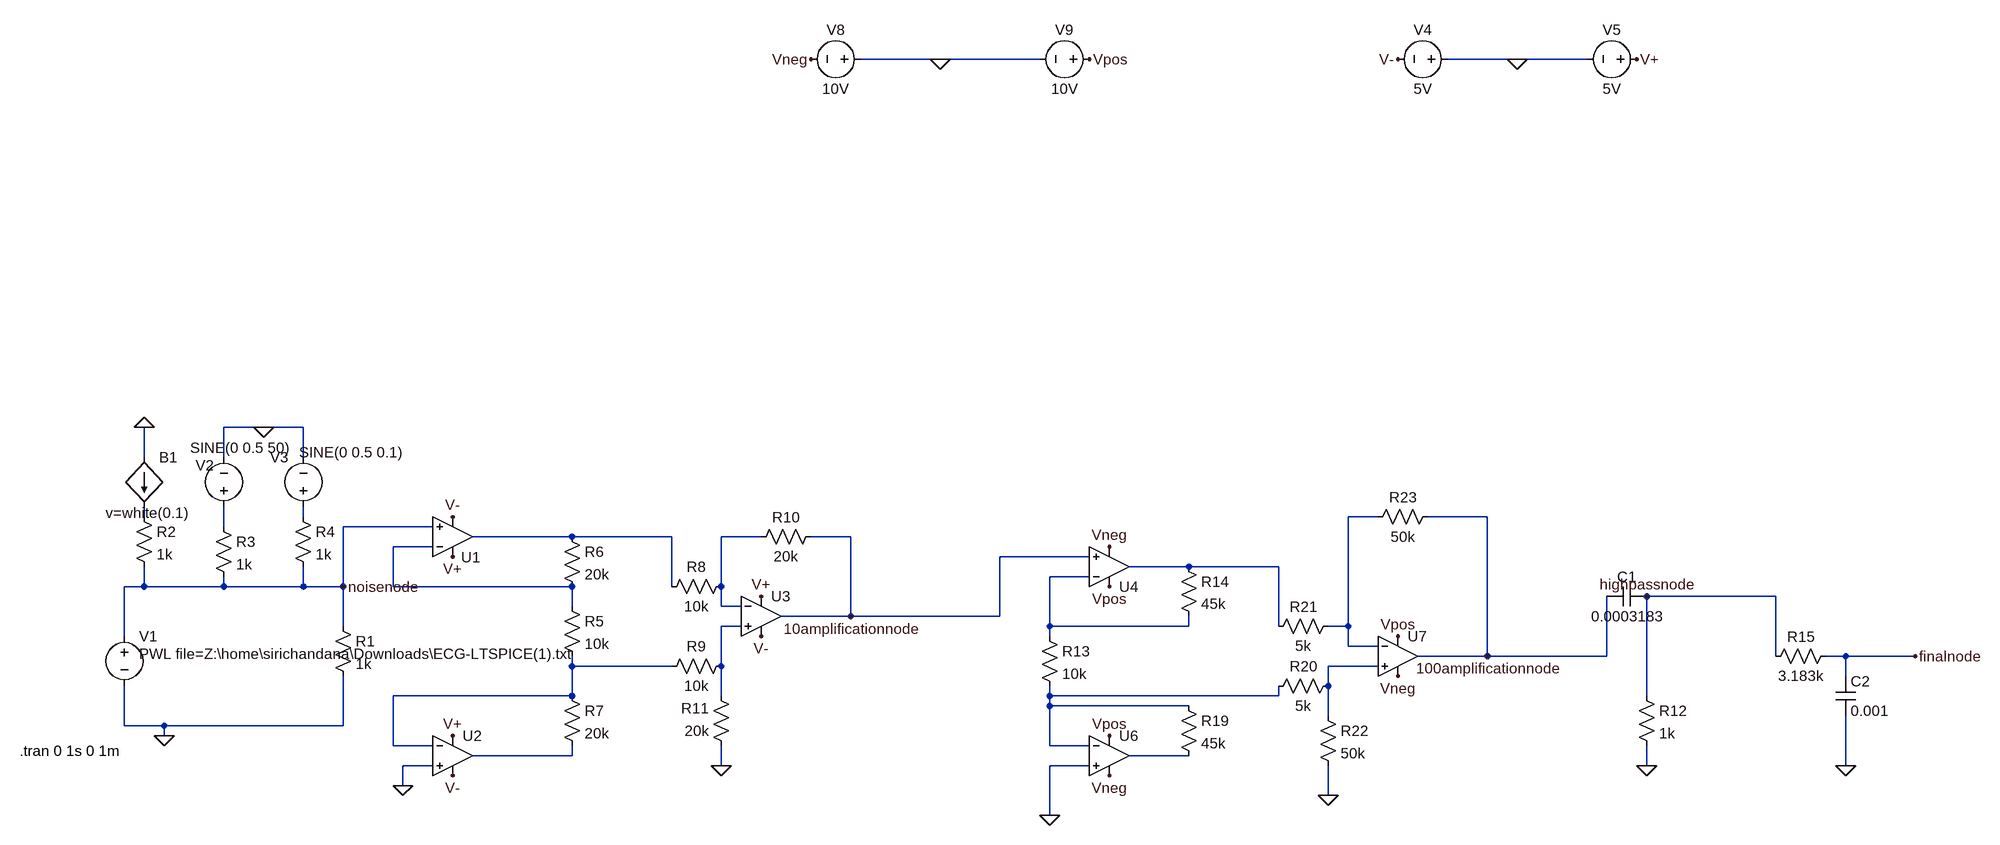
[diagram p0: schematic NEWsirichandanawinterprojectps1.asc]
NEWsirichandanawinterprojectps1.asc, the LTspice schematic file:
Version 4
SHEET 1 16100 740
WIRE -1392 -560 -1520 -560
WIRE -1232 -560 -1392 -560
WIRE -464 -560 -576 -560
WIRE -352 -560 -464 -560
WIRE -2480 32 -2544 32
WIRE -2416 32 -2480 32
WIRE -2672 80 -2672 32
WIRE -2544 80 -2544 32
WIRE -2416 80 -2416 32
WIRE -2672 176 -2672 160
WIRE -2416 176 -2416 160
WIRE -688 176 -736 176
WIRE -512 176 -608 176
WIRE -2544 192 -2544 160
WIRE -2208 192 -2352 192
WIRE -1984 208 -2144 208
WIRE -1824 208 -1984 208
WIRE -1680 208 -1744 208
WIRE -1536 208 -1600 208
WIRE -2208 224 -2272 224
WIRE -1152 240 -1296 240
WIRE -992 256 -1088 256
WIRE -848 256 -992 256
WIRE -1152 272 -1216 272
WIRE -2672 288 -2672 256
WIRE -2672 288 -2704 288
WIRE -2544 288 -2544 272
WIRE -2544 288 -2672 288
WIRE -2416 288 -2416 256
WIRE -2416 288 -2544 288
WIRE -2352 288 -2352 192
WIRE -2352 288 -2416 288
WIRE -2272 288 -2272 224
WIRE -1984 288 -2272 288
WIRE -1824 288 -1824 208
WIRE -1744 288 -1744 208
WIRE -48 304 -256 304
WIRE -1984 320 -1984 288
WIRE -1744 320 -1744 288
WIRE -1712 320 -1744 320
WIRE -1536 336 -1536 208
WIRE -1536 336 -1648 336
WIRE -1296 336 -1296 240
WIRE -1296 336 -1536 336
WIRE -2352 352 -2352 288
WIRE -1712 352 -1744 352
WIRE -1216 352 -1216 272
WIRE -992 352 -992 336
WIRE -992 352 -1216 352
WIRE -848 352 -848 256
WIRE -736 352 -736 176
WIRE -736 352 -768 352
WIRE -2704 368 -2704 288
WIRE -1216 368 -1216 352
WIRE -736 384 -736 352
WIRE -688 384 -736 384
WIRE -512 400 -512 176
WIRE -512 400 -624 400
WIRE -320 400 -320 304
WIRE -320 400 -512 400
WIRE -48 400 -48 304
WIRE 64 400 32 400
WIRE 176 400 64 400
WIRE -1984 416 -1984 400
WIRE -1824 416 -1984 416
WIRE -1744 416 -1744 352
WIRE -688 416 -768 416
WIRE 64 432 64 400
WIRE -768 448 -768 416
WIRE -1984 464 -1984 416
WIRE -1984 464 -2272 464
WIRE -1744 464 -1744 416
WIRE -1216 464 -1216 448
WIRE -848 464 -848 448
WIRE -848 464 -1216 464
WIRE -256 464 -256 304
WIRE -1216 480 -1216 464
WIRE -992 480 -1216 480
WIRE -768 496 -768 448
WIRE -2704 512 -2704 448
WIRE -2640 512 -2704 512
WIRE -2352 512 -2352 432
WIRE -2352 512 -2640 512
WIRE -2640 528 -2640 512
WIRE -2272 544 -2272 464
WIRE -2208 544 -2272 544
WIRE -1216 544 -1216 480
WIRE -1152 544 -1216 544
WIRE -1984 560 -1984 544
WIRE -1984 560 -2144 560
WIRE -992 560 -1088 560
WIRE -2208 576 -2256 576
WIRE -1744 576 -1744 544
WIRE -1152 576 -1216 576
WIRE -256 576 -256 544
WIRE 64 576 64 496
WIRE -2256 608 -2256 576
WIRE -768 624 -768 576
WIRE -1216 656 -1216 576
FLAG -2640 528 0
FLAG -2672 32 0
FLAG -2480 32 0
FLAG -2352 288 noisenode
FLAG -2256 608 0
FLAG -1744 576 0
FLAG -464 -560 0
FLAG -272 -560 V+
FLAG -656 -560 V-
FLAG -2176 176 V-
FLAG -2176 592 V-
FLAG -1680 368 V-
FLAG -2176 528 V+
FLAG -1680 304 V+
FLAG -256 576 0
FLAG -1536 336 10amplificationnode
FLAG -256 304 highpassnode
FLAG 64 576 0
FLAG 176 400 finalnode
FLAG -2176 240 V+
FLAG -1216 656 0
FLAG -768 624 0
FLAG -512 400 100amplificationnode
FLAG -1392 -560 0
FLAG -1600 -560 Vneg
FLAG -1152 -560 Vpos
FLAG -656 368 Vpos
FLAG -656 432 Vneg
FLAG -1120 224 Vneg
FLAG -1120 592 Vneg
FLAG -1120 288 Vpos
FLAG -1120 528 Vpos
SYMBOL voltage -2704 352 R0
WINDOW 123 0 0 Left 2
WINDOW 39 0 0 Left 2
WINDOW 3 24 44 Left 2
SYMATTR InstName V1
SYMATTR Value PWL file=Z:\home\sirichandana\Downloads\ECG-LTSPICE(1).txt
SYMBOL res -2368 336 R0
SYMATTR InstName R1
SYMATTR Value 1k
SYMBOL voltage -2544 176 R180
WINDOW 0 16 83 Left 2
WINDOW 3 -106 111 Left 2
WINDOW 123 0 0 Left 2
WINDOW 39 0 0 Left 2
SYMATTR InstName V2
SYMATTR Value SINE(0 0.5 50)
SYMBOL voltage -2416 176 R180
WINDOW 0 24 96 Left 2
WINDOW 3 -160 104 Left 2
WINDOW 123 0 0 Left 2
WINDOW 39 0 0 Left 2
SYMATTR InstName V3
SYMATTR Value SINE(0 0.5 0.1)
SYMBOL bi -2672 80 R0
WINDOW 3 -62 89 Left 2
SYMATTR Value v=white(0.1)
SYMATTR InstName B1
SYMBOL res -2688 160 R0
SYMATTR InstName R2
SYMATTR Value 1k
SYMBOL res -2560 176 R0
SYMATTR InstName R3
SYMATTR Value 1k
SYMBOL res -2432 160 R0
SYMATTR InstName R4
SYMATTR Value 1k
SYMBOL res -2000 304 R0
SYMATTR InstName R5
SYMATTR Value 10k
SYMBOL res -2000 192 R0
SYMATTR InstName R6
SYMATTR Value 20k
SYMBOL res -2000 448 R0
SYMATTR InstName R7
SYMATTR Value 20k
SYMBOL res -1728 272 R90
WINDOW 0 0 56 VBottom 2
WINDOW 3 32 56 VTop 2
SYMATTR InstName R8
SYMATTR Value 10k
SYMBOL res -1728 400 R90
WINDOW 0 0 56 VBottom 2
WINDOW 3 32 56 VTop 2
SYMATTR InstName R9
SYMATTR Value 10k
SYMBOL res -1584 192 R90
WINDOW 0 0 56 VBottom 2
WINDOW 3 32 56 VTop 2
SYMATTR InstName R10
SYMATTR Value 20k
SYMBOL res -1728 560 R180
WINDOW 0 36 76 Left 2
WINDOW 3 36 40 Left 2
SYMATTR InstName R11
SYMATTR Value 20k
SYMBOL Opamps\\UniversalOpamp2 -2176 208 M180
WINDOW 0 14 -33 Left 2
SYMATTR InstName U1
SYMBOL Opamps\\UniversalOpamp2 -1680 336 R0
SYMATTR InstName U3
SYMBOL Opamps\\UniversalOpamp2 -2176 560 R0
SYMATTR InstName U2
SYMBOL voltage -560 -560 R90
WINDOW 0 -32 56 VBottom 2
WINDOW 3 32 56 VTop 2
WINDOW 123 0 0 Left 2
WINDOW 39 0 0 Left 2
SYMATTR InstName V4
SYMATTR Value 5V
SYMBOL voltage -256 -560 R90
WINDOW 0 -32 56 VBottom 2
WINDOW 3 32 56 VTop 2
SYMATTR InstName V5
SYMATTR Value 5V
SYMBOL cap -256 288 R90
WINDOW 0 0 32 VBottom 2
WINDOW 3 32 32 VTop 2
SYMATTR InstName C1
SYMATTR Value 0.0003183
SYMBOL res -272 448 R0
SYMATTR InstName R12
SYMATTR Value 1k
SYMBOL cap 48 432 R0
SYMATTR InstName C2
SYMATTR Value 0.001
SYMBOL res 48 384 R90
WINDOW 0 0 56 VBottom 2
WINDOW 3 32 56 VTop 2
SYMATTR InstName R15
SYMATTR Value 3.183k
SYMBOL Opamps\\UniversalOpamp2 -1120 256 M180
SYMATTR InstName U4
SYMBOL Opamps\\UniversalOpamp2 -1120 560 R0
SYMATTR InstName U6
SYMBOL Opamps\\UniversalOpamp2 -656 400 R0
SYMATTR InstName U7
SYMBOL res -1232 352 R0
SYMATTR InstName R13
SYMATTR Value 10k
SYMBOL res -1008 240 R0
SYMATTR InstName R14
SYMATTR Value 45k
SYMBOL res -1008 464 R0
SYMATTR InstName R19
SYMATTR Value 45k
SYMBOL res -752 432 R90
WINDOW 0 0 56 VBottom 2
WINDOW 3 32 56 VTop 2
SYMATTR InstName R20
SYMATTR Value 5k
SYMBOL res -752 336 R90
WINDOW 0 0 56 VBottom 2
WINDOW 3 32 56 VTop 2
SYMATTR InstName R21
SYMATTR Value 5k
SYMBOL res -592 160 R90
WINDOW 0 0 56 VBottom 2
WINDOW 3 32 56 VTop 2
SYMATTR InstName R23
SYMATTR Value 50k
SYMBOL res -784 480 R0
SYMATTR InstName R22
SYMATTR Value 50k
SYMBOL voltage -1504 -560 R90
WINDOW 0 -32 56 VBottom 2
WINDOW 3 32 56 VTop 2
WINDOW 123 0 0 Left 2
WINDOW 39 0 0 Left 2
SYMATTR InstName V8
SYMATTR Value 10V
SYMBOL voltage -1136 -560 R90
WINDOW 0 -32 56 VBottom 2
WINDOW 3 32 56 VTop 2
WINDOW 123 0 0 Left 2
WINDOW 39 0 0 Left 2
SYMATTR InstName V9
SYMATTR Value 10V
TEXT -2872 552 Left 2 !.tran 0 1s 0 1m

The netlist it stands for:
* NEWsirichandanawinterprojectps1.asc
V1 noisenode 0 PWL file=Z:\home\sirichandana\Downloads\ECG-LTSPICE(1).txt
R1 noisenode 0 1k
V2 N004 0 SINE(0 0.5 50)
V3 N002 0 SINE(0 0.5 0.1)
B1 0 N001 v=white(0.1)
R2 N001 noisenode 1k
R3 N004 noisenode 1k
R4 N002 noisenode 1k
R5 N007 N011 10k
R6 N005 N007 20k
R7 N011 N014 20k
R8 N006 N005 10k
R9 N010 N011 10k
R10 10amplificationnode N006 20k
R11 0 N010 20k
XU1 noisenode N007 V+ V- N005 level.2 Avol=1Meg GBW=10Meg Slew=10Meg ilimit=25m rail=0 Vos=0 phimargin=45 en=0 enk=0 in=0 ink=0 Rin=500Meg  ; pins IN+ IN- V+ V- OUT
XU3 N010 N006 V+ V- 10amplificationnode level.2 Avol=1Meg GBW=10Meg Slew=10Meg ilimit=25m rail=0 Vos=0 phimargin=45 en=0 enk=0 in=0 ink=0 Rin=500Meg  ; pins IN+ IN- V+ V- OUT
XU2 0 N011 V+ V- N014 level.2 Avol=1Meg GBW=10Meg Slew=10Meg ilimit=25m rail=0 Vos=0 phimargin=45 en=0 enk=0 in=0 ink=0 Rin=500Meg  ; pins IN+ IN- V+ V- OUT
V4 0 V- 5V
V5 V+ 0 5V
C1 highpassnode 100amplificationnode 0.0003183
R12 highpassnode 0 1k
C2 finalnode 0 0.001
R15 finalnode highpassnode 3.183k
XU4 10amplificationnode N009 Vpos Vneg N008 level.2 Avol=1Meg GBW=10Meg Slew=10Meg ilimit=25m rail=0 Vos=0 phimargin=45 en=0 enk=0 in=0 ink=0 Rin=500Meg  ; pins IN+ IN- V+ V- OUT
XU6 0 N013 Vpos Vneg N015 level.2 Avol=1Meg GBW=10Meg Slew=10Meg ilimit=25m rail=0 Vos=0 phimargin=45 en=0 enk=0 in=0 ink=0 Rin=500Meg  ; pins IN+ IN- V+ V- OUT
XU7 N012 N003 Vpos Vneg 100amplificationnode level.2 Avol=1Meg GBW=10Meg Slew=10Meg ilimit=25m rail=0 Vos=0 phimargin=45 en=0 enk=0 in=0 ink=0 Rin=500Meg  ; pins IN+ IN- V+ V- OUT
R13 N009 N013 10k
R14 N008 N009 45k
R19 N013 N015 45k
R20 N012 N013 5k
R21 N003 N008 5k
R23 100amplificationnode N003 50k
R22 N012 0 50k
V8 0 Vneg 10V
V9 Vpos 0 10V
.tran 0 1s 0 1m
.lib UniversalOpamps2.sub
.backanno
.end

* Results of the author's LTspice run, read from the files saved beside the schematic
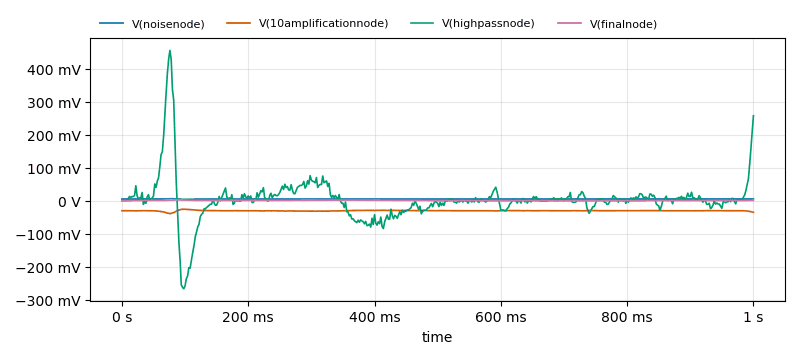
[diagram p1: Transient Analysis of NEWsirichandanawinterprojectps1.asc, plotted from the saved traces]
* Transient Analysis, 1 run:
*   V(noisenode): min 4.31 mV, max 6.49 mV, average 5.069 mV, rms 5.073 mV, last 5.85 mV
*   V(10amplificationnode): min -38.94 mV, max -25.86 mV, average -30.41 mV, rms 30.44 mV, last -35.1 mV
*   V(highpassnode): min -267.4 mV, max 456.5 mV, average 2.406 mV, rms 67.72 mV, last 257.8 mV
*   V(finalnode): min -75.14 µV, max 2.618 mV, average 463.5 µV, rms 788.5 µV, last 610.5 µV